# EAGLE design bikebadge (EAGLE 7.2.0)
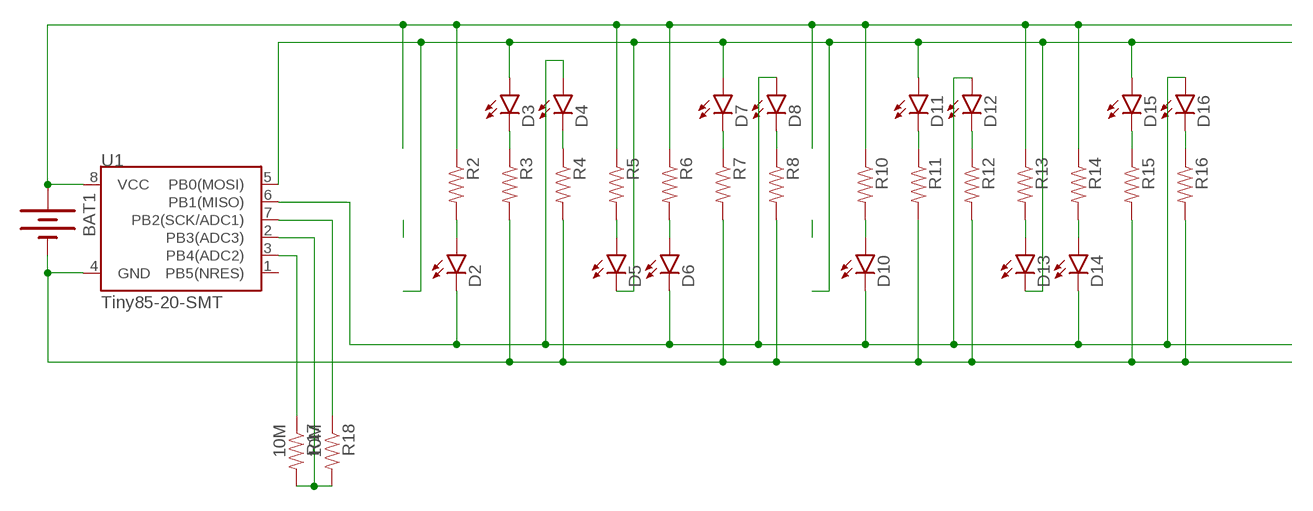
[diagram p0: schematic, sheet 1]

## Parts
BAT1  BATTERY20PTH  [BATTCOM_20MM_PTH]
D2  LED  [LED-REV-MNT]
D3  LED  [LED-REV-MNT]
D4  LED  [LED-REV-MNT]
D5  LED  [LED-REV-MNT]
D6  LED  [LED-REV-MNT]
D7  LED  [LED-REV-MNT]
D8  LED  [LED-REV-MNT]
D10  LED  [LED-REV-MNT]
D11  LED  [LED-REV-MNT]
D12  LED  [LED-REV-MNT]
D13  LED  [LED-REV-MNT]
D14  LED  [LED-REV-MNT]
D15  LED  [LED-REV-MNT]
D16  LED  [LED-REV-MNT]
R2  RESISTOR1206  [1206]
R3  RESISTOR1206  [1206]
R4  RESISTOR1206  [1206]
R5  RESISTOR1206  [1206]
R6  RESISTOR1206  [1206]
R7  RESISTOR1206  [1206]
R8  RESISTOR1206  [1206]
R10  RESISTOR1206  [1206]
R11  RESISTOR1206  [1206]
R12  RESISTOR1206  [1206]
R13  RESISTOR1206  [1206]
R14  RESISTOR1206  [1206]
R15  RESISTOR1206  [1206]
R16  RESISTOR1206  [1206]
R17  10M  RESISTOR0805-RES  [0805]
R18  10M  RESISTOR0805-RES  [0805]
U1  Tiny85-20-SMT  ATTINY45TINY85-20-SMT  [SO08-EIAJ]

## Nets
CAP0: R17.1 U1.3(PB4(ADC2))
CAP1: R18.1 U1.7(PB2(SCK/ADC1))
GND: BAT1.2(-) R3.2 R4.2 R7.2 R8.2 R11.2 R12.2 R15.2 R16.2 U1.4(GND)
N$2: D2.A R2.2
N$3: D3.C R3.1
N$4: D4.C R4.1
N$5: D5.A R5.2
N$6: D6.A R6.2
N$7: D16.C R16.1
N$8: D15.C R15.1
N$14: D10.A R10.2
N$15: D12.C R12.1
N$16: D11.C R11.1
N$17: D8.C R8.1
N$18: D7.C R7.1
N$21: D13.A R13.2
N$22: D14.A R14.2
PWM0: D3.A D5.C D7.A D11.A D13.C D15.A U1.5(PB0(MOSI))
PWM1: D2.C D4.A D6.C D8.A D10.C D12.A D14.C D16.A U1.6(PB1(MISO))
SENSE: R17.2 R18.2 U1.2(PB3(ADC3))
VCC: BAT1.1(+) R2.1 R5.1 R6.1 R10.1 R13.1 R14.1 U1.8(VCC)
Unconnected: U1.1(PB5(NRES))

## Library data of the parts
BAT1 = SparkFun-Electromechanical:BATTERY: Battery Holders Various common sizes : AA, AAA, 18650 (PRT-12895), 20mm coin cell and 12mm coin cell. 20MM_4LEGS, BATT-10373
D2-D8 D10-D16 = LED:LED: LEDs Standard schematic elements and footprints for 5mm, 3mm, 1206, and 0603 sized LEDs. 5mm - Spark Fun Electronics SKU : COM-00529 (and others)
R2-R8 R10-R18 = SparkFun-Passives:RESISTOR: Resistor Basic schematic elements and footprints for 0603, 1206, and PTH resistors.
U1 = SparkFun-DigitalIC:ATTINY45: Atmel 8-pin 2/4/8kB flash uC; PROD_ID: IC-09092

## Board
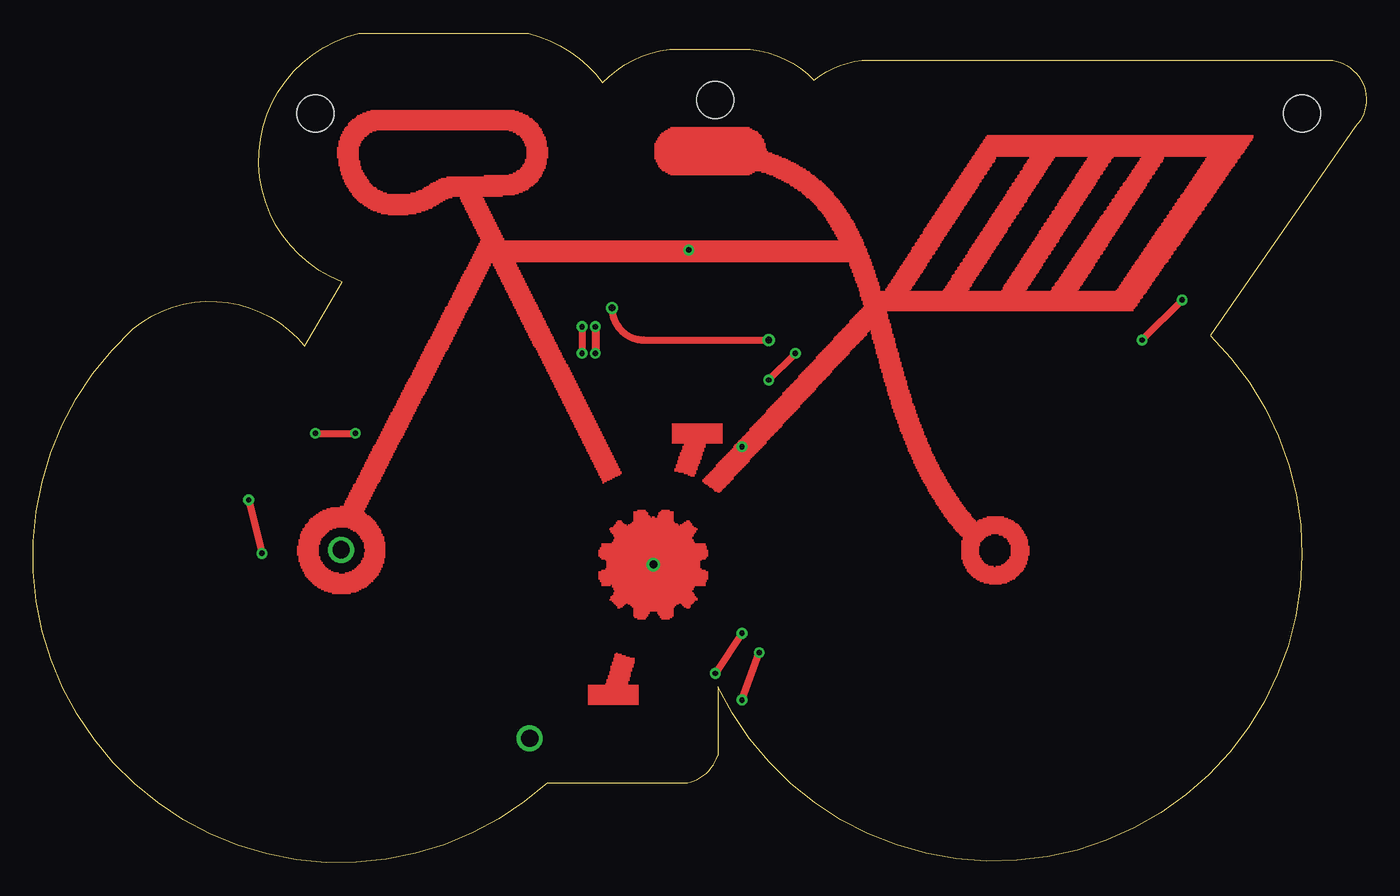
[diagram p1: board, top side]
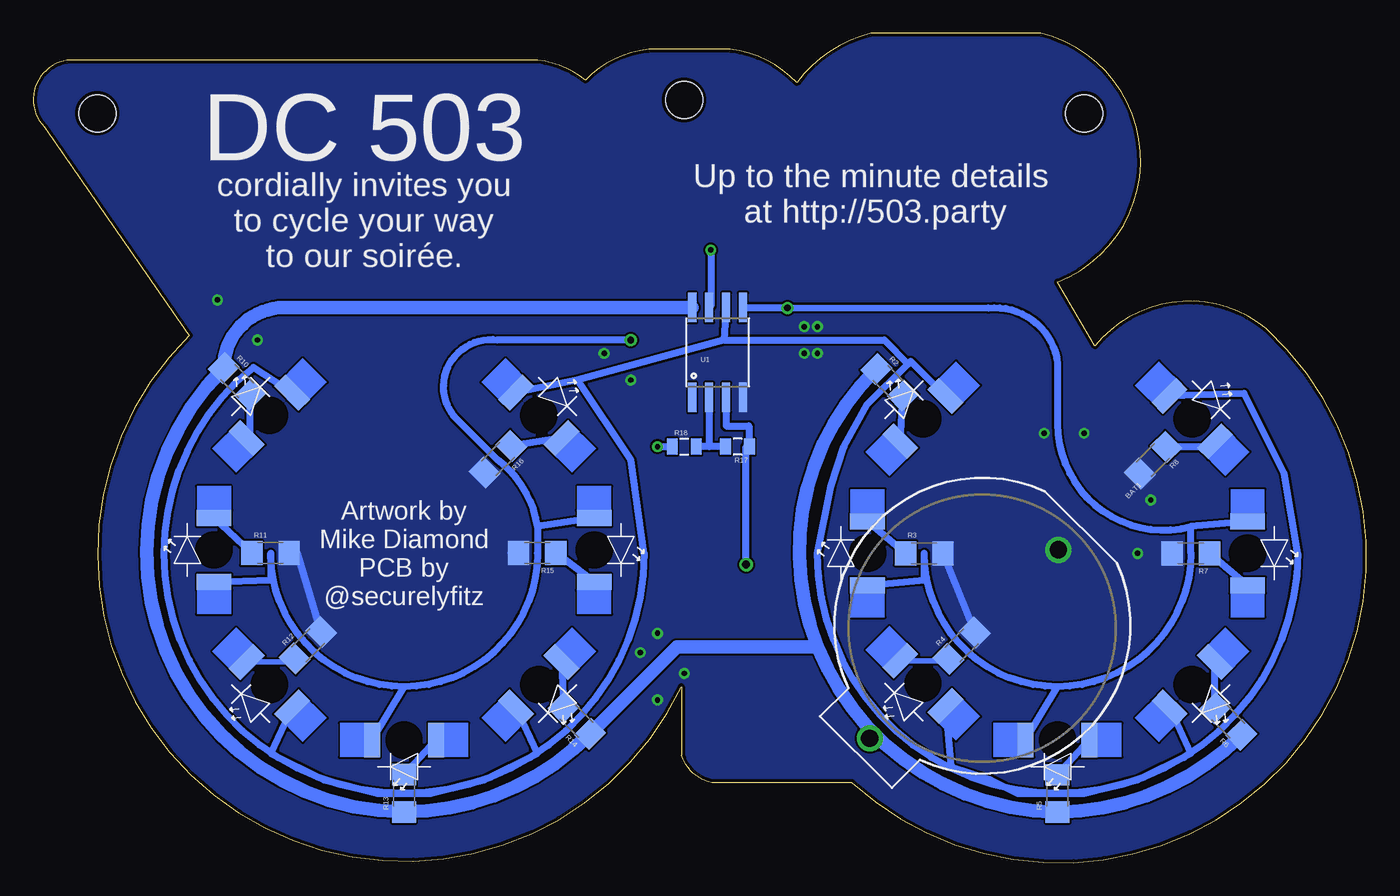
[diagram p2: board, bottom side, seen from below]

Size 99.94 x 62.19 mm. Coordinates in mm from the lower left corner, seen from the top.
Outline: 38.54,5.99 arc-180 7.49,40.04 arc-90 20.34,38.74 23.14,43.54 arc-145 24.39,62.19 37.14,62.19 arc-40 42.69,58.49 arc-40 47.69,60.99 53.79,60.99 arc-40 58.54,58.69 arc-30 62.14,60.19 97.14,60.19 arc-130 99.14,55.19 88.24,39.54 arc-200 51.34,13.19 51.34,8.04 arc-60 49.04,5.99 38.54,5.99
Copper layers (1*16): Top 0.035mm / dielectric 1.5mm / Bottom 0.035mm
Design rules "DFRobot_Eagle_Rule_v0.4": minimum track width 6mil, minimum drill 12mil, track to track 6mil, track to pad 6mil, pad to pad 6mil, via to via 6mil, smd to smd 0mil, copper to edge 10mil, drill to drill 10mil, minimum pad ring 12mil, minimum via ring 8mil, stop-mask expansion 2mil, vias tented up to drill 25mil, thermal gap 10mil
Holes 2.8 mm at 95.14,56.19 21.14,56.19 51.14,57.19

### Footprints (pad centres in the part's own frame; a part is rotated, then mirrored left to right if it is on the bottom)
BATTCOM_20MM_PTH = drill 1.3: 1 11.85,0; 2 -8.15,0
LED-REV-MNT = smd 1.2 x 2.6: A -2.4,0; C 2.4,0
1206 = smd 1.6 x 1.8: 1 -1.4,0; 2 1.4,0
0805 = smd 0.8 x 1.2: 1 -0.9,0; 2 0.9,0
SO08-EIAJ = smd 0.61 x 2.21: 1 -1.905,-3.378; 2 -0.635,-3.378; 3 0.635,-3.378; 4 1.905,-3.378; 5 1.905,3.353; 6 0.635,3.353; 7 -0.635,3.353; 8 -1.905,3.353

### Placement (x,y rotation side)
BAT1  28.84,17.69 225 bottom
D2  33.24,33.29 45 bottom
D3  37.39,23.19 90 bottom
D4  33.24,13.44 135 bottom
D5  23.14,9.19 180 bottom
D6  13.04,13.34 225 bottom
D7  8.89,23.19 270 bottom
D8  13.04,33.29 315 bottom
D10  82.24,33.54 45 bottom
D11  86.39,23.44 90 bottom
D12  82.24,13.34 135 bottom
D13  72.14,9.19 180 bottom
D14  62.04,13.34 225 bottom
D15  57.89,23.44 270 bottom
D16  62.04,33.54 315 bottom
R2  35.73,36.03 315 bottom
R3  33.14,23.19 0 bottom
R4  30.33,16.27 45 bottom
R5  23.15,5.18 90 bottom
R6  10.34,10.58 135 bottom
R7  13.14,23.19 180 bottom
R8  15.99,30.18 225 bottom
R10  84.67,36.1 315 bottom
R11  82.16,23.2 0 bottom
R12  79.35,16.3 45 bottom
R13  72.15,5.19 90 bottom
R14  59.2,10.63 135 bottom
R15  62.16,23.23 180 bottom
R16  65.11,30.25 225 bottom
R17  47.14,31.19 180 bottom
R18  51.14,31.19 0 bottom
U1  48.63,38.27 0 bottom
U$1  [BIKE]  0.14,0.19 0 top

### Tracks (layer width: path | path; a pad name or v marks a point on that pad's centre or on a via)
CAP0  (via drill 0.6)
  Bottom 0.54: U1.3 48,32.74 46.29,32.74 46.29,31.19 R17.1 46.49,31.19 v46.49,22.34
CAP1  (via drill 0.4)
  Top 0.54: v49.14,45.94 61.39,45.94 arc-90 62.14,45.19 arc37 63.14,42.19 63.14,41.19 v53.14,31.19
  Bottom 0.54: v53.14,31.19 R18.1 | v49.14,45.94 49.14,41.75 U1.7
GND  (via drill 0.4)
  Top 0.54: v16.14,27.19 v17.14,23.19 | v21.14,32.19 v24.14,32.19 | v41.14,40.19 v41.14,38.19 | v53.14,12.19 54.44,15.79 | v53.14,17.19 v51.14,14.19 | v55.14,36.19 v57.14,38.19 | v86.14,42.19 v83.14,39.19
  Top 0.61: v42.14,40.19 v42.14,38.19
  Bottom 0.54: R4.2 R3.2 32.14,23.19 | R12.2 80.14,23.19 R11.2 | R15.2 64.07,23.2 64.14,23.19
  other vias: 54.44,15.74
  pour Bottom (rank 6, no thermals): 0.14,0.19 100.14,0.19 100.14,65.19 0.14,65.19
N$2
  Bottom 0.54: D2.A R2.2
N$3
  Bottom 0.54: D3.C R3.1
N$4
  Bottom 0.406: D4.C 31.32,15.14 R4.1
N$5
  Bottom 0.54: R5.2 D5.A
N$6
  Bottom 0.54: R6.2 D6.A
N$7
  Bottom 0.54: D16.C R16.1
N$8
  Bottom 0.54: D15.C R15.1
N$14
  Bottom 0.54: D10.A 83.68,32.1 R10.2
N$15
  Bottom 0.406: D12.C 80.34,15.04 R12.1
N$16
  Bottom 0.54: R11.1 D11.C
N$17
  Bottom 0.54: D8.C arc90 12.02,31.17 R8.1
N$18
  Bottom 0.54: D7.C R7.1
N$21
  Bottom 0.54: R13.2 D13.A
N$22
  Bottom 0.54: D14.A R14.2
PWM0  (via drill 0.5)
  Top 0.54: v43.39,41.59 arc90 45.79,39.19 v55.14,39.19
  Bottom 0.54: 23.14,13.19 arc-90 13.14,23.19 13.14,25.19 | 23.14,13.19 arc90 33.14,23.19 33.14,21.19 D3.A | D7.A 13.14,25.19 | D5.C 23.14,13.19 | 72.14,13.19 arc90 82.14,23.19 82.14,21.19 D11.A | 72.14,13.19 arc-90 62.14,23.19 62.14,25.19 | D13.C 72.14,13.19 | D15.A 62.14,25.19 | 13.14,25.19 arc105 23.14,32.89 23.14,37.39 arc-90 28.34,41.59 U1.5 43.39,41.62 v43.39,41.59 | v55.14,39.19 65.14,39.19 arc-143 68.14,33.19 65.14,30.19 arc45 62.14,25.19
PWM1
  Bottom 0.54: 23.14,5.19 arc-90 5.14,23.19 6.14,29.19 9.14,35.19 D8.A | 23.14,5.19 arc90 41.14,23.19 40.14,28.19 39.14,31.19 37.39,34.39 34.35,37.39 | D4.A 31.14,7.19 28.14,6.19 26.14,5.19 23.14,5.19 | 23.14,5.19 21.14,5.19 17.14,6.19 13.14,8.19 D6.C | 72.14,5.19 arc90 90.14,23.19 arc45 84.69,36.09 83.44,37.14 D10.C | 72.14,5.19 arc-90 54.14,23.19 55.14,30.19 59.14,36.19 | D12.A 82.14,8.19 78.14,6.19 74.14,5.19 72.14,5.19 | 72.14,5.19 70.14,5.19 66.14,6.19 62.14,8.19 D14.C | 59.14,36.19 D16.A | 34.35,37.39 34.14,37.59 D2.C | U1.6 48.14,39.19 | 48.14,39.19 36.14,39.19 34.35,37.39 | 48.14,39.19 59.14,36.19
SENSE
  Bottom 0.54: U1.2 49.27,31.19 | 49.27,31.19 R18.2 | R17.2 49.27,31.19
VCC
  Bottom 0.254: BAT1.1 41.14,16.19
  Bottom 1: R6.1 arc45 R5.1 arc68 41.14,16.19 | 41.14,16.19 arc68 R2.1 | 41.14,16.19 51.66,16.19 R14.1 arc45 R13.1 arc135 R10.1 arc90 81.13,41.62 U1.8

### Text on the board
bPlace: DC 503 | Artwork by / Mike Diamond / PCB by / @securelyfitz
bNames: Up to the minute details / at http://503.party | cordially invites you / to cycle your way / to our soirée.